# Altium schematic sheet Motor_Driver_2.SchDoc
size A4; SheetNumber: 9; SheetTotal: 12
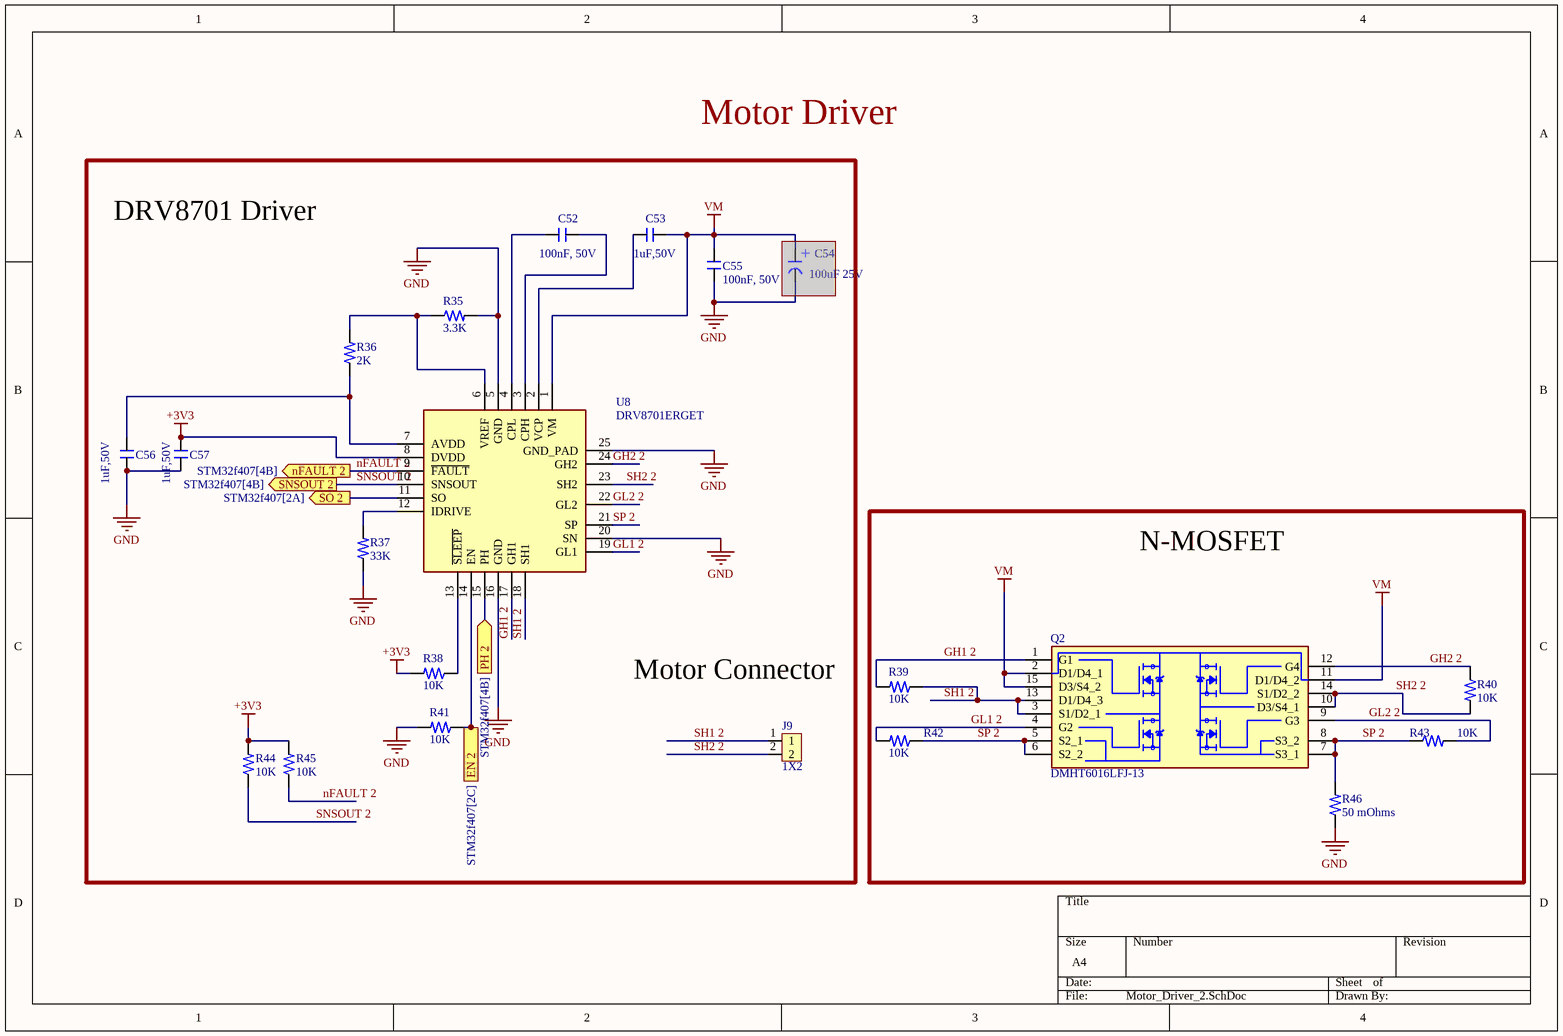
[diagram p0: Motor_Driver_2.SchDoc]

## Parts
C52  100nF, 50V  [Capacitor_0805]
C53  1uF,50V  [Capacitor_0805]
C54  100uF 25V  [Capacitor_Radial_SMD_6.3mm_Dia]  (masked out: inside a compile mask, not in the netlist)
C55  100nF, 50V  [Capacitor_0805]
C56  1uF,50V  [Capacitor_0805]
C57  1uF,50V  [Capacitor_0805]
J9  1X2  [1X2_2.53_JST]
Q2  DMHT6016LFJ-13  [V-DFN5045-12]
R35  3.3K  [Resistor_0603]
R36  2K  [Resistor_0603]
R37  33K  [Resistor_0805]
R38  10K  [Resistor_0603]
R39  10K  [Resistor_0603]
R40  10K  [Resistor_0603]
R41  10K  [Resistor_0603]
R42  10K  [Resistor_0603]
R43  10K  [Resistor_0603]
R44  10K  [Resistor_0603]
R45  10K  [Resistor_0603]
R46  50 mOhms  [Resistor_2512]
U8  DRV8701ERGET  [24_VQFN_4X4]

## Blocks framed on the sheet
N-MOSFET: Q2 R39 R40 R42 R43 R46

## Ports
EN 2 (in, see STM32f407[2C]), nFAULT 2 (out, see STM32f407[4B]), PH 2 (in, see STM32f407[4B]), SNSOUT 2 (out, see STM32f407[4B]), SO 2 (out, see STM32f407[2A])

## Nets
+3V3: C57.2 R38.2 R44.2 R45.2 U8.8(DVDD)
GND: C55.1 C56.1 C57.1 R35.2 R37.1 R41.2 R46.1 U8.5(GND) U8.16(GND) U8.20(SN) U8.25(GND_PAD)
VM: C53.2 C55.2 Q2.2(D1/D4_1) Q2.11(D1/D4_2) Q2.15(D3/S4_2) U8.1(VM)
EN 2: R41.1 U8.14(EN) ; port EN 2
GH1 2: Q2.1(G1) R39.2 U8.17(GH1)
GH2 2: Q2.12(G4) R40.1 U8.24(GH2)
GL1 2: Q2.4(G2) R42.2 U8.19(GL1)
GL2 2: Q2.9(G3) R43.2 U8.22(GL2)
nFAULT 2: R45.1 U8.9(~{FAULT}) ; port nFAULT 2
PH 2: U8.15(PH) ; port PH 2
SH1 2: J9.1 Q2.3(S1/D2_1) Q2.13(D1/D4_3) R39.1 U8.18(SH1)
SH2 2: J9.2 Q2.10(D3/S4_1) Q2.14(S1/D2_2) R40.2 U8.23(SH2)
SNSOUT 2: R44.1 U8.10(SNSOUT) ; port SNSOUT 2
SO 2: U8.11(SO) ; port SO 2
SP 2: Q2.5(S2_1) Q2.6(S2_2) Q2.7(S3_1) Q2.8(S3_2) R42.1 R43.1 R46.2 U8.21(SP)
NetC52_1: C52.1 U8.4(CPL)
NetC52_2: C52.2 U8.3(CPH)
NetC53_1: C53.1 U8.2(VCP)
NetC56_2: C56.2 R36.1 U8.7(AVDD)
NetR35_1: R35.1 R36.2 U8.6(VREF)
NetR37_2: R37.2 U8.12(IDRIVE)
NetR38_1: R38.1 U8.13(~{SLEEP})

## Notes on the sheet
- Motor Driver
- DRV8701 Driver
- Motor Connector
- (in symbol CAP_100uF_25V_Alum) +

## Library data of the parts
C52 C55 = Cap_100nF_0805: Multilayer Ceramic Capacitor, 0.1 uF, 50 V, ï¿½ 10%, X7R, 0805 [2012 Metric]; Manufacturer: Samsung; Manufacturer Part Number: CL21B104KBCNNNC; Supplier: Digikey; Supplier Part Number: 1276-1003-1-ND; RoHS: Yes; Category: Ceramic Capacitors; Stock: 674609; Pricing: 1=0,08, 10=0,012, 100=0,0104, 1000=0,008 (USD); Mounting Technology: Surface Mount; Case/Package: 0805; Case Code (Metric): 2012; Case Code (Imperial): 0805; Material: Ceramic; Min Operating Temperature: -55°C; Max Operating Temperature: 125°C; Tolerance: 10%; Value: 100nF; Dielectric: X7R; Packaging: Tape and Reel; Voltage Rating: 50V; Voltage: 50V; Series: CL; Construction: Flat; Voltage Rating (DC): 50V; Length: 2mm; Width: 0.049inch; Height: 0.85mm; Depth: 1.25mm; Thickness: 0.037inch; Radiation Hardening: No; RoHS Compliant: Yes; Lead Free: 5697LeadFree; ComponentLink1URL: https://datasheet.ciiva.com/25710/cl21b104kbcnnnc-25710182.pdf?src-supplier=Digikey; ComponentLink1Description: https://datasheet.ciiva.com/25710/cl21b104kbcnnnc-25710182.pdf?src-supplier=Digikey; ComponentLink2URL: https://datasheet.ciiva.com/29199/454152-da-01-en-vs-kondensator-0805-29199814.pdf?src-supplier=Conrad; ComponentLink2Description: https://datasheet.ciiva.com/29199/454152-da-01-en-vs-kondensator-0805-29199814.pdf?src-supplier=Conrad
C53 C56 C57 = Cap_1uF_0805: 0805 1 uF 50 V ±5 % Tolerance X7R Surface Mount Multilayer Ceramic Capacitor; Manufacturer: Yageo; Manufacturer Part Number: CC0805JKX7R9BB105; Material: 4241ConductorMaterial; Dielectric: 1511DielectricType; Supplier: Digikey; Supplier Part Number: 311-3498-1-ND; RoHS: Yes; Category: Ceramic Capacitors; Stock: 30160; Pricing: 1=0,29, 10=0,168, 100=0,1077, 1000=0,07673 (USD); Voltage Rating (DC): 50V; Height: 1.45mm; Lead Free: 5697LeadFree; Halogen Free: 5694HalogenFree; ComponentLink1URL: https://datasheet.octopart.com/CC0805JKX7R9BB105-Yageo-datasheet-137700082.pdf?src-supplier=Future+Electronics; ComponentLink1Description: https://datasheet.octopart.com/CC0805JKX7R9BB105-Yageo-datasheet-137700082.pdf?src-supplier=Future+Electronics; ComponentLink2URL: http://www.yageo.com/documents/recent/UPY-GPHC_X7R_6.3V-to-50V_18.pdf?src-supplier=Digikey; ComponentLink2Description: http://www.yageo.com/documents/recent/UPY-GPHC_X7R_6.3V-to-50V_18.pdf?src-supplier=Digikey; ComponentLink3URL: https://datasheet.octopart.com/CC0805JKX7R9BB105-Yageo-datasheet-151948686.pdf?src-supplier=Farnell; ComponentLink3Description: https://datasheet.octopart.com/CC0805JKX7R9BB105-Yageo-datasheet-151948686.pdf?src-supplier=Farnell
C54 = CAP_100uF_25V_Alum: Radial Can - SMD ALUMINUM ELECTROLYTIC CAPACITOR UWT 25V 100muF ±20% 0.248Dia 6.30mm; Manufacturer: Nichicon; Manufacturer Part Number: UWT1E101MCL1GS; Dielectric Material: 158ConductorMaterial; Polarity: 5066Direction; Supplier: Digikey; Supplier Part Number: 493-2190-1-ND; RoHS: Yes; Category: Aluminum Electrolytic Capacitors; Stock: 63623; Pricing: 1=0,39, 10=0,257, 50=0,1994, 100=0,1803, 900=0,13583, 1800=0,12559, 2700=0,12025, 4500=0,11412, 6300=0,11042, 9000=0,10676, 22500=0,09846, 45000=0,09311, 90000=0,08845 (USD); Lead Free: 5697LeadFree; ComponentLink1URL: https://datasheet.ciiva.com/11776/0900766b80fa3a91-11776931.pdf?src-supplier=Rs; ComponentLink1Description: https://datasheet.ciiva.com/11776/0900766b80fa3a91-11776931.pdf?src-supplier=Rs; ComponentLink2URL: https://datasheet.ciiva.com/96/e-wt-96674.pdf?src-supplier=Digikey; ComponentLink2Description: https://datasheet.ciiva.com/96/e-wt-96674.pdf?src-supplier=Digikey; ComponentLink3URL: https://datasheet.ciiva.com/96/e-wt-96675.pdf?src-supplier=Digikey; ComponentLink3Description: https://datasheet.ciiva.com/96/e-wt-96675.pdf?src-supplier=Digikey; ComponentLink4URL: https://datasheet.ciiva.com/96/e-wt-96676.pdf?src-supplier=Digikey; ComponentLink4Description: https://datasheet.ciiva.com/96/e-wt-96676.pdf?src-supplier=Digikey; ComponentLink5URL: https://datasheet.ciiva.com/7851/e-wt-7851752.pdf?src-supplier=Element14; ComponentLink5Description: https://datasheet.ciiva.com/7851/e-wt-7851752.pdf?src-supplier=Element14
J9 = CON_JST_1X2_2.54: Conn Shrouded Header HDR 2 POS 2.5mm Solder ST Thru-Hole Box; Manufacturer: JST; Manufacturer Part Number: B2B-XH-2(LF)(SN); Number of Contacts: 2NUMBER; Number of Positions: 2; Voltage Rating: 250V; Supplier: Mouser; Supplier Part Number: 306-B2B-XH-2LFSN; RoHS: Yes; Category: Headers and Wire Housings; Stock: 1704; Pricing: 1=0,2, 10=0,158, 50=0,131, 100=0,117, 1000=0,072, 10000=0,07 (USD); Mounting Technology: Through Hole; Contact Material: Brass; Contact Shape: Square; Contact Finish - Mating: TIN; Insulation Material: Nylon; Insulation Color: Natural; Min Operating Temperature: -25°C; Max Operating Temperature: 85°C; Number of Rows: 1; Termination: Press-Fit; Series: XH; Packaging: Bulk; Contact Type: Male Pin; Connector Type: Header; Fastening Type: Detent; Flammability Rating: UL94 V-0
Q2 = IC_MOSFET_ARRAY_4N: Transistor MOSFET Array Quad N-CH 60V 14.8A 12-Pin VDFN T/R; Manufacturer: Diodes; FET Type: 4 N-Channel; Rds On Max: 22mR; Input Capacitance: 864pF; Supplier: Digikey; Supplier Part Number: DMHT6016LFJ-13DICT-ND; Manufacturer Part Number: DMHT6016LFJ-13; RoHS: Yes; Category: MOSFETs; Stock: 8228; Pricing: 1=2,31, 10=1,485, 100=1,0129, 500=0,81076, 1000=0,74579 (USD); Mounting Technology: Surface Mount; Min Operating Temperature: -55°C; Max Operating Temperature: 150°C; Packaging: Cut Tape; Continuous Drain Current (ID): 14.8A; Series: Automotive, AEC-Q101; ComponentLink1URL: https://www.diodes.com/assets/Datasheets/DMHT6016LFJ.pdf?src-supplier=Digikey; ComponentLink1Description: https://www.diodes.com/assets/Datasheets/DMHT6016LFJ.pdf?src-supplier=Digikey
R35 = R_3.3K_0603: Res Thick Film 0603 3.3K Ohm 1% 0.1W(1/10W) ±100ppm/C Pad SMD T/R; Manufacturer: Walsin Technologies; Manufacturer Part Number: WR06X3301FTL; Value: 3.3kR; Voltage Rating: 75V; Power Rating: 100mW; Temperature Coefficient: 100ppm/°C; Supplier: Digikey; Supplier Part Number: 1292-WR06X3301FTLCT-ND; RoHS: Yes; Category: Chip SMD Resistors; Stock: 24599; Pricing: 1=0,1, 10=0,015, 50=0,0086, 100=0,0068, 500=0,00418, 1000=0,00345 (USD); Mounting Technology: Surface Mount; Case/Package: 0603; Case Code (Metric): 1608; Case Code (Imperial): 0603; Contact Material: 154ConductorMaterial; Resistor Type: Thick Film; Packaging: Tape and Reel; Resistance Tolerance: 1%; Voltage Rating (DC): 75V; Reach SVHC Compliant: Unknown; RoHS Compliant: Yes; Lead Free: 5697LeadFree; ComponentLink1URL: http://www.farnell.com/datasheets/1960319.pdf?src-supplier=Farnell; ComponentLink1Description: http://www.farnell.com/datasheets/1960319.pdf?src-supplier=Farnell; ComponentLink2URL: https://datasheet.octopart.com/WR06X3301FTL-Walsin-Technologies-datasheet-48038251.pdf?src-supplier=Element14; ComponentLink2Description: https://datasheet.octopart.com/WR06X3301FTL-Walsin-Technologies-datasheet-48038251.pdf?src-supplier=Element14; ComponentLink3URL: http://www.farnell.com/datasheets/1960319.pdf?src-supplier=Element14; ComponentLink3Description: http://www.farnell.com/datasheets/1960319.pdf?src-supplier=Element14; ComponentLink4URL: https://datasheet.octopart.com/WR06X3301FTL-Walsin-Technologies-datasheet-32780790.pdf?src-supplier=Future+Electronics; ComponentLink4Description: https://datasheet.octopart.com/WR06X3301FTL-Walsin-Technologies-datasheet-32780790.pdf?src-supplier=Future+Electronics
R36 = R_2k_0603: Res Thin Film 0603 2K Ohm 1% 0.125W(1/8W) ±100ppm/C Sulfur Resistant Pad SMD T/R; Manufacturer: Stackpole Electronics; Manufacturer Part Number: RNCP0603FTD2K00; Value: 2kR; Max Power Dissipation: 125mW; Temperature Coefficient: 100ppm/°C; Voltage Rating: 150V; Supplier: Digikey; Supplier Part Number: RNCP0603FTD2K00CT-ND; RoHS: Yes; Category: Chip SMD Resistors; Stock: 64735; Pricing: 1=0,1, 10=0,012, 50=0,0108, 100=0,0106, 500=0,00848 (USD); Mounting Technology: Surface Mount; Case/Package: 0603; Case Code (Metric): 1608; Case Code (Imperial): 0603; Min Operating Temperature: -55°C; Max Operating Temperature: 155°C; Tolerance: 1%; Packaging: Cut Tape; Number of Terminations: 2; Features: Moisture Resistant,Anti-Sulfur; Series: RNCP; Length: 0.059inch; Width: 0.031inch; Height: 0.02inch; Lead Free: Lead Free; RoHS Compliant: Yes; ComponentLink1URL: https://www.seielect.com/catalog/SEI-Packaging.pdf?src-supplier=Digikey; ComponentLink1Description: https://www.seielect.com/catalog/SEI-Packaging.pdf?src-supplier=Digikey
R37 = R_33K_0805: Res Thick Film 0805 33K Ohm 1% 0.125W(1/8W) ±100ppm/C Pad SMD T/R; Manufacturer: TE Connectivity; Manufacturer Part Number: CRG0805F33K; Value: 33kR; Power Rating: 125mW; Voltage Rating: 150V; Temperature Coefficient: 100ppm/°C; Number of Resistors: 1; Supplier: Digikey; Supplier Part Number: A126362CT-ND; RoHS: Yes; Category: Chip SMD Resistors; Stock: 31419; Pricing: 1=0,1, 10=0,037, 100=0,019, 1000=0,01105, 2500=0,00928 (USD); Mounting Technology: Surface Mount; Case/Package: 0805; Case Code (Imperial): 0805; Case Code (Metric): 2012; Min Operating Temperature: -55°C; Max Operating Temperature: 125°C; Tolerance: 1%; Packaging: Tape and Reel; Termination: Solder; Resistor Type: Thick Film; Number of Terminations: 2; Series: CRG; Technology: THICK FILM; Max Power Dissipation: 125mW; Voltage Rating (DC): 150V; Operating Supply Voltage: 150V; Length: 2mm; Width: 1.25mm; Height: 0.55mm; Depth: 1.25mm; ELV: Compliant; RoHS Compliant: Yes; Military Standard: Not; ComponentLink1URL: https://datasheet.ciiva.com/2530/eng-cd-1623197-ba-2530138.pdf?src-supplier=Digikey; ComponentLink1Description: https://datasheet.ciiva.com/2530/eng-cd-1623197-ba-2530138.pdf?src-supplier=Digikey; ComponentLink2URL: https://datasheet.ciiva.com/11818/0900766b800a696e-11818279.pdf?src-supplier=Rs; ComponentLink2Description: https://datasheet.ciiva.com/11818/0900766b800a696e-11818279.pdf?src-supplier=Rs; ComponentLink3URL: https://datasheet.ciiva.com/5597/eng-ds-1773204-g-5597309.pdf?src-supplier=Mouser; ComponentLink3Description: https://datasheet.ciiva.com/5597/eng-ds-1773204-g-5597309.pdf?src-supplier=Mouser; ComponentLink4URL: https://datasheet.ciiva.com/16772/70063020-16772846.pdf?src-supplier=Allied+Electronics; ComponentLink4Description: https://datasheet.ciiva.com/16772/70063020-16772846.pdf?src-supplier=Allied+Electronics
R38-R45 = R_10K_0603: SMD Chip Resistor, 10 kOhm, ï¿½ 1%, 100 mW, 0603 [1608 Metric], Thick Film, General Purpose; Manufacturer: Yageo; Manufacturer Part Number: RC0603FR-0710KL; Voltage Rating (DC): 50V; Value: 10kR; Temperature Coefficient: 100ppm/°C; Voltage Rating: 75V; Power Rating: 100mW; Supplier: Digikey; Supplier Part Number: 311-10.0KHRCT-ND; RoHS: Yes; Category: Chip SMD Resistors; Stock: 2808060; Pricing: 1=0,1, 10=0,009, 100=0,0071, 1000=0,00612 (USD); Case/Package: 0603; Pins: 2; Case Code (Imperial): 0603; Case Code (Metric): 1608; Weight: 7.1E-05oz; Min Operating Temperature: -55°C; Max Operating Temperature: 155°C; Tolerance: 1%; Resistor Type: Thick Film; Packaging: Tape and Reel; Termination: SMD/SMT; Features: Moisture Resistant; Series: RC; Max Power Dissipation: 100mW; Number of Terminations: 2; Resistance Tolerance: 1%; Construction: Rectangular; Length: 1.6mm; Width: 0.8mm; Height: 0.45mm; Depth: 0.8mm; Lead Pitch: 0.3mm; Reach SVHC Compliant: No; Lead Free: 5697LeadFree; RoHS Compliant: Yes; Military Standard: Not; ComponentLink1URL: https://datasheet.ciiva.com/7660/38590-7660789.pdf?src-supplier=Element14; ComponentLink1Description: https://datasheet.ciiva.com/7660/38590-7660789.pdf?src-supplier=Element14; ComponentLink2URL: https://datasheet.ciiva.com/7983/443971-7983596.pdf?src-supplier=Element14; ComponentLink2Description: https://datasheet.ciiva.com/7983/443971-7983596.pdf?src-supplier=Element14; ComponentLink3URL: https://datasheet.ciiva.com/22747/443971-22747519.pdf?src-supplier=Element14; ComponentLink3Description: https://datasheet.ciiva.com/22747/443971-22747519.pdf?src-supplier=Element14; ComponentLink4URL: https://datasheet.ciiva.com/46440/1868787-46440891.pdf?src-supplier=Element14; ComponentLink4Description: https://datasheet.ciiva.com/46440/1868787-46440891.pdf?src-supplier=Element14; ComponentLink5URL: https://datasheet.ciiva.com/7746/1738695-7746239.pdf?src-supplier=Element14; ComponentLink5Description: https://datasheet.ciiva.com/7746/1738695-7746239.pdf?src-supplier=Element14; ComponentLink6URL: https://datasheet.ciiva.com/15189/getdatasheetpartid-409289-15189591.pdf?src-supplier=Verical; ComponentLink6Description: https://datasheet.ciiva.com/15189/getdatasheetpartid-409289-15189591.pdf?src-supplier=Verical
R46 = R_50mOhms_2012: Res Current Sense Metal Film 2512 50m Ohm 1% 2W ±100ppm/°C Molded Emboss T/R; Manufacturer: Yageo; Manufacturer Part Number: PA2512FKF7W0R05E; Value: 50mR; Supplier: Digikey; Supplier Part Number: YAG6100CT-ND; RoHS: Yes; Category: Chip SMD Resistors; Stock: 10433; Pricing: 1=0,8, 10=0,521, 25=0,444, 50=0,3958, 100=0,3549, 250=0,31004, 500=0,28194, 1000=0,25807 (USD); Case/Package: 2512; Case Code (Imperial): 2512; Case Code (Metric): 6432; Min Operating Temperature: -55°C; Max Operating Temperature: 170°C; Features: Moisture Resistant,Automotive AEC-Q200; Series: PA_E; Packaging: Cut Tape; Tolerance: 1%; Max Power Dissipation: 2W; Temperature Coefficient: 100ppm/°C; Number of Terminations: 2; Power Rating: 2W; Height: 880um; Ratings: AEC-Q200; RoHS Compliant: Yes
U8 = IC_Motor_DriverDRV8701ERGET: 4.5V to 60V, 2A Step-Down Power Module in QFN Package 43-B3QFN -40 to 105; Manufacturer: Texas Instruments; Supplier: Mouser; Supplier Part Number: 595-DRV8701ERGET; Manufacturer Part Number: DRV8701ERGET; RoHS: Yes; Category: Integrated Circuits (ICs); Stock: 1460; Pricing: 1=2,56, 10=1,91, 50=1,75, 100=1,57, 1000=1,35, 10000=1,28 (USD); Pins: 24NUMBER; Length: 4mm; Width: 4mm; Height: 1mm; Thickness: 880um; Lead Free: 5697LeadFree; ComponentLink1URL: http://www.ti.com/lit/ds/symlink/drv8701.pdf?src-supplier=Digikey; ComponentLink1Description: http://www.ti.com/lit/ds/symlink/drv8701.pdf?src-supplier=Digikey; ComponentLink2URL: http://www.ti.com/general/docs/lit/getliterature.tsp?genericPartNumber=DRV8701&&fileType=pdf&src-supplier=Avnet; ComponentLink2Description: http://www.ti.com/general/docs/lit/getliterature.tsp?genericPartNumber=DRV8701&&fileType=pdf&src-supplier=Avnet